# EAGLE design mini48U-v0.6.9 (EAGLE 6.1)
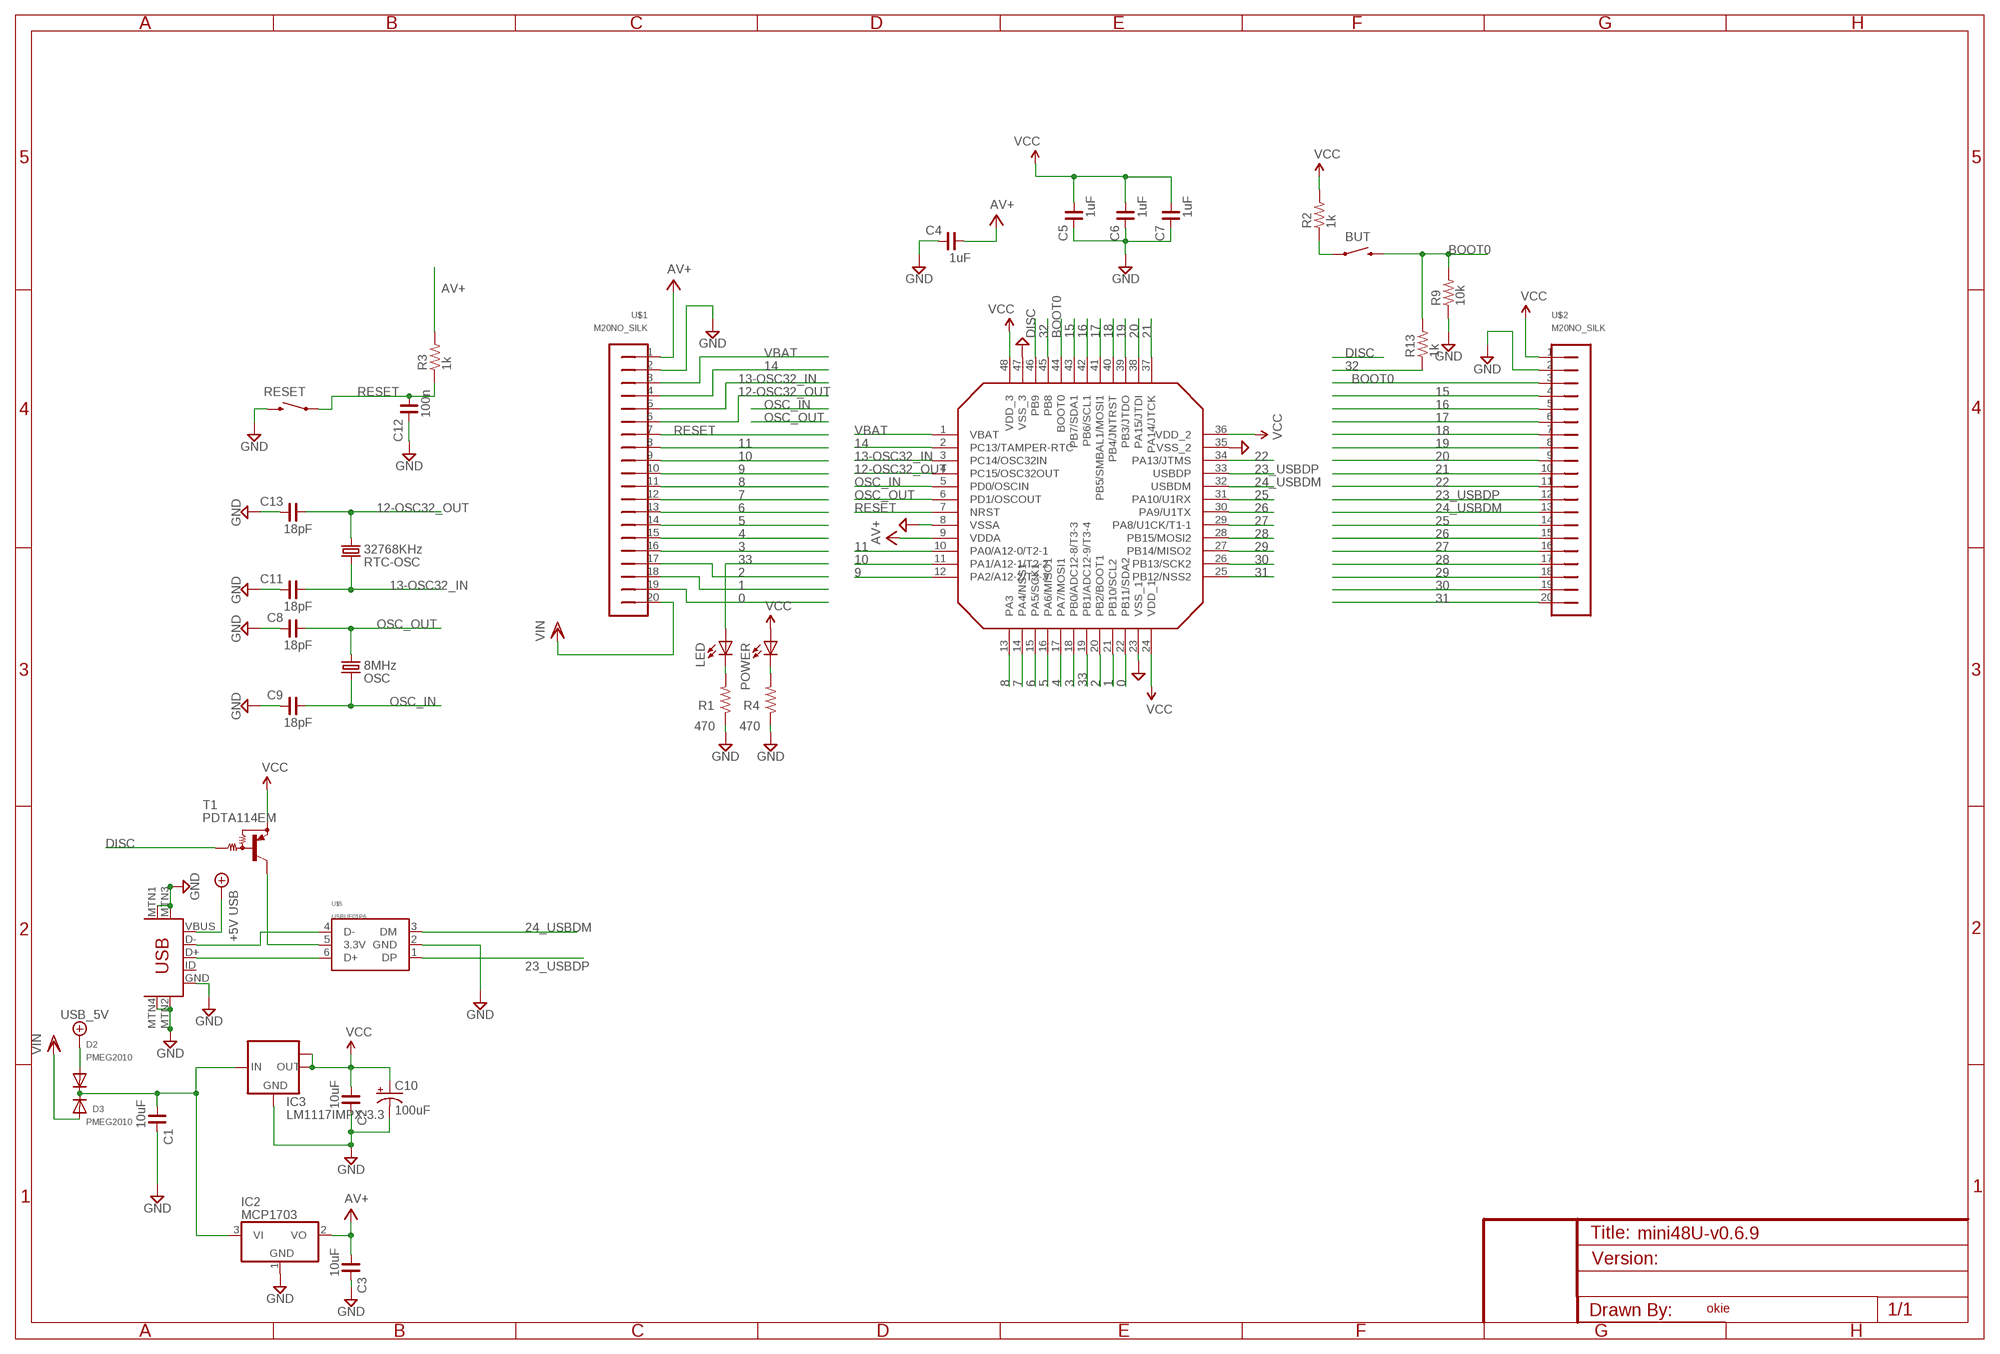
[diagram p0: schematic, sheet 1]

## Parts
BUT  SWITCH-MOMENTARY-2KMR211_NO_GND  [KMR211NG]
C1  10uF  C_0805  [C0805]
C2  10uF  C_0805  [C0805]
C3  10uF  C_0805  [C0805]
C4  1uF  C_0402  [C0402]
C5  1uF  C_0402  [C0402]
C6  1uF  C_0402  [C0402]
C7  1uF  C_0402  [C0402]
C8  18pF  C_0402  [C0402]
C9  18pF  C_0402  [C0402]
C10  100uF  CAP_POL3528  [EIA3528]
C11  18pF  C_0402  [C0402]
C12  100n  C_0402  [C0402]
C13  18pF  C_0402  [C0402]
D2  PMEG2010  DIODESOD-323  [SOD-323]
D3  PMEG2010  DIODESOD-323  [SOD-323]
IC2  MCP1703  [SOT23-3]
IC3  LM1117IMPX-3.3  [SOT223]
LED  LED  LEDKA-3528ASYC  [KA-3528ASYC]
OSC  8MHz  CRYSTALTC38H  [TC38H]
POWER  green  LEDCHIP-LED0603  [CHIP-LED0603]
R1  470  R_0402  [R0402]
R2  1k  R_0402  [R0402]
R3  1k  R_0402  [R0402]
R4  470  R_0402  [R0402]
R9  10k  R_0402  [R0402]
R13  1k  R_0402  [R0402]
RESET  SWITCH-MOMENTARY-2KMR211_NO_GND  [KMR211NG]
RTC-OSC  32768KHz  CRYSTALTC26H  [TC26H]
T1  PDTA114EM  PNP-DRIVERSOT723  [SOT-723]
U$1  M20NO_SILK  [1X20_NO_SILK]
U$2  M20NO_SILK  [1X20_NO_SILK]
U$4  STM32F103_48  [LQFP48-7X7]
U$5  USBUF01P6  [SOT-666]
USB  USB-MINIB-5PIN  [USB-MINIB]

## Nets
0: U$1.19 U$4.22(PB11/SDA2)
1: U$1.18 U$4.21(PB10/SCL2)
2: U$1.17 U$4.20(PB2/BOOT1)
3: U$1.16 U$4.18(PB0/ADC12-8/T3-3)
4: U$1.15 U$4.17(PA7/MOSI1)
5: U$1.14 U$4.16(PA6/MISO1)
6: U$1.13 U$4.15(PA5/SCK1)
7: U$1.12 U$4.14(PA4/NSS1)
8: U$1.11 U$4.13(PA3)
9: U$1.10 U$4.12(PA2/A12-2/T2-3)
10: U$1.9 U$4.11(PA1/A12-1/T2-2)
11: U$1.8 U$4.10(PA0/A12-0/T2-1)
12-OSC32_OUT: C13.1 RTC-OSC.1 U$1.6 U$4.4(PC15/OSC32OUT)
13-OSC32_IN: C11.1 RTC-OSC.2 U$1.5 U$4.3(PC14/OSC32IN)
14: U$1.4 U$4.2(PC13/TAMPER-RTC)
15: U$2.4 U$4.43(PB7/SDA1)
16: U$2.5 U$4.42(PB6/SCL1)
17: U$2.6 U$4.41(PB5/SMBAL1/MOSI1)
18: U$2.7 U$4.40(PB4/JNTRST)
19: U$2.8 U$4.39(PB3/JTDO)
20: U$2.9 U$4.38(PA15/JTDI)
21: U$2.10 U$4.37(PA14/JTCK)
22: U$2.11 U$4.34(PA13/JTMS)
23_USBDP: U$2.12 U$4.33(USBDP) U$5.1(DP)
24_USBDM: U$2.13 U$4.32(USBDM) U$5.3(DM)
25: U$2.14 U$4.31(PA10/U1RX)
26: U$2.15 U$4.30(PA9/U1TX)
27: U$2.16 U$4.29(PA8/U1CK/T1-1)
28: U$2.17 U$4.28(PB15/MOSI2)
29: U$2.18 U$4.27(PB14/MISO2)
30: U$2.19 U$4.26(PB13/SCK2)
31: U$2.20 U$4.25(PB12/NSS2)
32: R13.1 U$4.45(PB8)
33: LED.A U$4.19(PB1/ADC12-9/T3-4)
+5V/2 [vcc]: D2.A USB.VBUS ; supply symbol labelled USB_5V, +5V USB
AV+ [vcc]: C3.1 C4.1 IC2.2(VO) R3.2 U$1.1 U$4.9(VDDA)
BOOT0: BUT.2 R9.2 R13.2 U$2.3 U$4.44(BOOT0)
DGND: C1.2 C2.2 C3.2 C4.2 C5.2 C6.2 C7.2 C8.2 C9.2 C10.C(-) C11.2 C12.2 C13.2 IC2.1(GND) IC3.1(GND) R1.1 R4.1 R9.1 RESET.2 U$1.2 U$2.2 U$4.8(VSSA) U$4.23(VSS_1) U$4.35(VSS_2) U$4.47(VSS_3) U$5.2(GND) USB.GND USB.MTN1(MTN2) USB.MTN2(MTN3) USB.MTN3(MTN1) USB.MTN4 ; supply symbol labelled GND
DISC: T1.1(B) U$4.46(PB9)
N$1: BUT.1 R2.1
N$2: LED.C R1.2
N$3: POWER.C R4.2
N$5 [vcc]: C1.1 D2.C D3.C IC2.3(VI) IC3.3(IN)
N$6: T1.3(C) U$5.5(3.3V)
N$14: U$5.4(D-) USB.D-
N$17: U$5.6(D+) USB.D+
OSC_IN: C9.1 OSC.2 U$4.5(PD0/OSCIN)
OSC_OUT: C8.1 OSC.1 U$4.6(PD1/OSCOUT)
RESET: C12.1 R3.1 RESET.1 U$1.7 U$4.7(NRST)
VBAT: U$1.3 U$4.1(VBAT)
VCC [vcc]: C2.1 C5.1 C6.1 C7.1 C10.A(+) IC3.2(OUT) IC3.TAB(OUT1) POWER.A R2.2 T1.2(E) U$2.1 U$4.24(VDD_1) U$4.36(VDD_2) U$4.48(VDD_3)
VIN [vcc]: D3.A U$1.20
Unconnected: USB.ID

## Notes on the sheet
- BOOT0
- okie

## Library data of the parts
BUT RESET = es:SWITCH-MOMENTARY-2
C1-C9 C11-C13 = rc-master-smd:C_: NON-POLARIZED CAP
C10 = es:CAP_POL: Capacitor Polarized These are standard SMD and PTH capacitors. Normally 10uF, 47uF, and 100uF in electrolytic and tantalum varieties. Always verify the external diameter of the through hole cap, it varies with capacity, voltage, and manufacturer. The EIA devices should be standard.
D2 D3 = es:DIODE: Diode SMADIODE - SMA Surface Mount Package 20V 1A Schottky Diode Digikey: 641-1014-6-ND DO-1N4148 - Through Hole Small Current Diode SOD-123 20V 1 A (.5mV Vf) Schottky Diode - Digikey: MBRX120TPMSCT-ND SOD-323 10V 570mA (.38mV Vf, 3ns) Schottky Diode - Digikey: ZLLS410CT-ND SOD-523 30V 30mA Schottky Diode (RB751S-40TE61) - Digikey: RB751S-40TE61CT-ND SOT23-R/W - SOT23 Package (R = Solder Paste/Reflow Ovens, W = Hand-Soldering) BAT54Film 40V 300mA - Digikey: 497-7162-1-ND
IC2 = es:MCP1703: 250 mA, 16V, Low Quiescent Current LDO Regulator Source: http://ww1.microchip.com/downloads/en/DeviceDoc/22049b.pdf
IC3 = lm1117:LM1117IMPX-*
LED POWER = led:LED: LED OSRAM: - CHIPLED LG R971, LG N971, LY N971, LG Q971, LY Q971, LO R971, LY R971 LH N974, LH R974 LS Q976, LO Q976, LY Q976 LO Q996 - Hyper CHIPLED LW Q18S LB Q993, LB Q99A, LB R99A - SideLED LS A670, LO A670, LY A670, LG A670, LP A670 LB A673, LV A673, LT A673, LW A673 LH A674 LY A675 LS A676, LA A676, LO A676, LY A676, LW A676 LS A679, LY A679, LG A679 - Hyper Micro SIDELED® LS Y876, LA Y876, LO Y876, LY Y876 LT Y87S - SmartLED LW L88C, LW L88S LB L89C, LB L89S, LG L890 LS L89K, LO L89K, LY L89K LS L896, LA L896, LO L896, LY L896 - TOPLED LS T670, LO T670, LY T670, LG T670, LP T670 LSG T670, LSP T670, LSY T670, LOP T670, LYG T670 LG T671, LOG T671, LSG T671 LB T673, LV T673, LT T673, LW T673 LH T674 LS T676, LA T676, LO T676, LY T676, LB T676, LH T676, LSB T676, LW T676 LB T67C, LV T67C, LT T67C, LS T67K, LO T67K, LY T67K, LW E67C LS E67B, LA E67B, LO E67B, LY E67B, LB E67C, LV E67C, LT E67C LW T67C LS T679, LY T679, LG T679 LS T770, LO T770, LY T770, LG T770, LP T770 LB T773, LV T773, LT T773, LW T773 LH T774 LS E675, LA E675, LY E675, LS T675 LS T776, LA T776, LO T776, LY T776, LB T776 LHGB T686 LT T68C, LB T68C - Hyper Mini TOPLED® LB M676 - Mini TOPLED Santana® LG M470 LS M47K, LO M47K, LY M47K Source: http://www.osram.convergy.de LUXEON: - LUMILED® LXK2-PW12-R00, LXK2-PW12-S00, LXK2-PW14-U00, LXK2-PW14-V00 LXK2-PM12-R00, LXK2-PM12-S00, LXK2-PM14-U00 LXK2-PE12-Q00, LXK2-PE12-R00, LXK2-PE12-S00, LXK2-PE14-T00, LXK2-PE14-U00 LXK2-PB12-K00, LXK2-PB12-L00, LXK2-PB12-M00, LXK2-PB14-N00, LXK2-PB14-P00, LXK2-PB14-Q00 LXK2-PR12-L00, LXK2-PR12-M00, LXK2-PR14-Q00, LXK2-PR14-R00 LXK2-PD12-Q00, LXK2-PD12-R00, LXK2-PD12-S00 LXK2-PH12-R00, LXK2-PH12-S00 LXK2-PL12-P00, LXK2-PL12-Q00, LXK2-PL12-R00 Source: www.luxeon.com KINGBRIGHT: KA-3528ASYC Source: www.kingbright.com
OSC RTC-OSC = SparkFun_20110922_my:CRYSTAL: Crystals Various standard crystals. Proven footprints. Spark Fun Electronics SKU : COM-00534
R1-R4 R9 R13 = rc-master-smd:R_: RESISTOR
T1 = es:PNP-DRIVER
U$1 U$2 = es:M20
U$4 = stm32_a:STM32F103_48
U$5 = es:USBUF
USB = SparkFun_20110922_my:USB-MINIB: Mini-USB "B" connector with 5th pin broken out. Created new symbol breaking out 5th "ID" pin in mini/micro USB connector spec. See: http://en.wikipedia.org/wiki/Mini_usb#Cables. Uses same footprint as 4-pin symbol. Also added pins to connect to mounting / shield pads if required (probably not generally needed as signals aren't shielded once they leave the connector).

## Net classes
1 vcc: width 0.25 mm

## Board
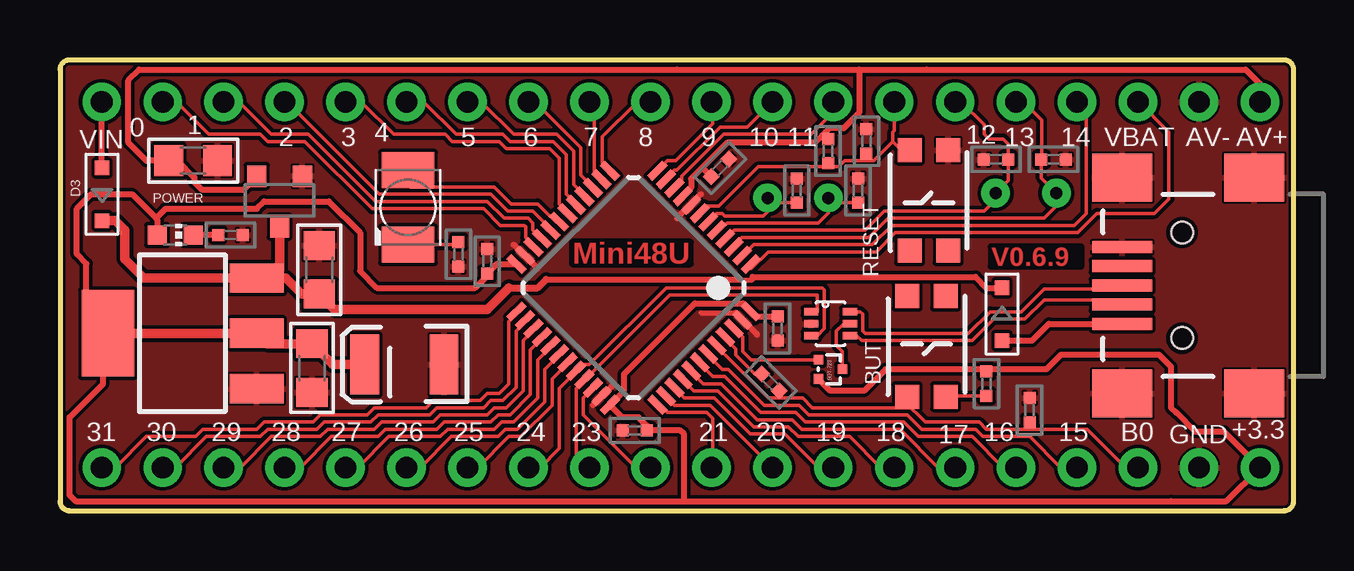
[diagram p1: board, top side]
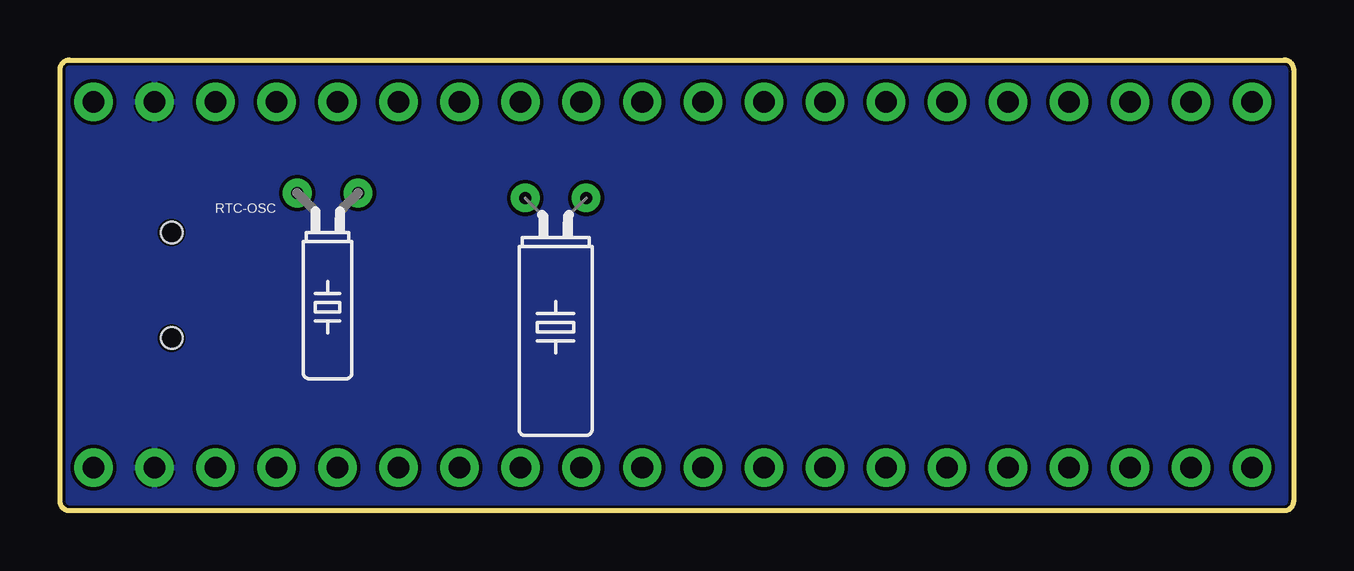
[diagram p2: board, bottom side, seen from below]

Size 51.4 x 18.8 mm. Coordinates in mm from the lower left corner, seen from the top.
Outline: 51,0 arc90 51.4,0.4 51.4,18.4 arc90 51,18.8 0.4,18.8 arc90 0,18.4 0,0.4 arc90 0.4,0 51,0
Copper layers (1*16): Top 0.018mm / dielectric 1.5mm / Bottom 0.018mm
Design rules: minimum track width 0.125mm, minimum drill 0.4mm, track to track 0.15mm, track to pad 0.15mm, pad to pad 0.15mm, via to via 0.15mm, smd to smd 0.15mm, copper to edge 0.12mm, drill to drill 0.15mm, minimum pad ring 0.35mm, minimum via ring 0.35mm, stop-mask expansion 0mil, vias tented up to drill 25mil, thermal gap 0.09mm
tRestrict: 1 lines

### Footprints (pad centres in the part's own frame; a part is rotated, then mirrored left to right if it is on the bottom)
KMR211NG = smd 1 x 1: 1 2.2,0.8; 2 2.2,-0.8; 3 -2,0.8; 4 -2,-0.8
C0805 = smd 1.2 x 1.3: 1 -1.016,0; 2 1.016,0
C0402 = smd 0.5 x 0.5: 1 -0.508,0; 2 0.508,0
EIA3528 = smd 1.2 x 2.5: A 1.65,0; C -1.65,0
SOD-323 = smd 0.6 x 0.6: A 1.1,0; C -1.1,0
SOT23-3 = smd 0.8 x 0.9: 1 -0.95,-1; 2 0.95,-1; 3 0,1.1
SOT223 = smd 1.219 x 2.235: 1 -2.311,-3.099; 2 0,-3.099; 3 2.311,-3.099 | smd 3.6 x 2.2: TAB 0,3.099
KA-3528ASYC = smd 1.5 x 2.2: A -1.55,0; C 1.55,0
TC38H = drill 0.5: 1 -1.27,0; 2 1.27,0
CHIP-LED0603 = smd 0.8 x 0.8: A 0,-0.75; C 0,0.75
R0402 = smd 0.5 x 0.5: 1 -0.508,0; 2 0.508,0
TC26H = drill 0.5: 1 -1.27,0; 2 1.27,0
SOT-723 = smd 0.4 x 0.4: 1 -0.4,-0.6; 2 0.4,-0.6; 3 0,0.4
1X20_NO_SILK = drill 0.9: 1 0,0; 2 2.54,0; 3 5.08,0; 4 7.62,0; 5 10.16,0; 6 12.7,0; 7 15.24,0; 8 17.78,0; 9 20.32,0; 10 22.86,0; 11 25.4,0; 12 27.94,0; 13 30.48,0; 14 33.02,0; 15 35.56,0; 16 38.1,0; 17 40.64,0; 18 43.18,0; 19 45.72,0; 20 48.26,0
LQFP48-7X7 = smd 0.9 x 0.3: 1 -4.15,2.75; 2 -4.15,2.25; 3 -4.15,1.75; 4 -4.15,1.25; 5 -4.15,0.75; 6 -4.15,0.25; 7 -4.15,-0.25; 8 -4.15,-0.75; 9 -4.15,-1.25; 10 -4.15,-1.75; 11 -4.15,-2.25; 12 -4.15,-2.75; 25 4.15,-2.75; 26 4.15,-2.25; 27 4.15,-1.75; 28 4.15,-1.25; 29 4.15,-0.75; 30 4.15,-0.25; 31 4.15,0.25; 32 4.15,0.75; 33 4.15,1.25; 34 4.15,1.75; 35 4.15,2.25; 36 4.15,2.75 | smd 0.3 x 0.9: 13 -2.75,-4.15; 14 -2.25,-4.15; 15 -1.75,-4.15; 16 -1.25,-4.15; 17 -0.75,-4.15; 18 -0.25,-4.15; 19 0.25,-4.15; 20 0.75,-4.15; 21 1.25,-4.15; 22 1.75,-4.15; 23 2.25,-4.15; 24 2.75,-4.15; 37 2.75,4.15; 38 2.25,4.15; 39 1.75,4.15; 40 1.25,4.15; 41 0.75,4.15; 42 0.25,4.15; 43 -0.25,4.15; 44 -0.75,4.15; 45 -1.25,4.15; 46 -1.75,4.15; 47 -2.25,4.15; 48 -2.75,4.15
SOT-666 = smd 0.3 x 0.6: 1 -0.5,-0.8; 2 0,-0.8; 3 0.5,-0.8; 4 0.5,0.81; 5 0,0.81; 6 -0.5,0.81
USB-MINIB = smd 2.5 x 0.5: D+ 2.5,0; D- 2.5,0.8; GND 2.5,-1.6; ID 2.5,-0.8; VBUS 2.5,1.6 | smd 2.5 x 2: MTN1 -3,4.5; MTN2 2.5,4.5; MTN3 -3,-4.5; MTN4 2.5,-4.5 | hole 0.9: 0,2.2; 0,-2.2

### Placement (x,y rotation side)
BUT  36.1,6.95 270 top
C1  10.8,10.05 90 top
C2  10.5,5.95 270 top
C3  5.55,14.6 0 top
C4  27.5,14.3 45 top
C5  23.95,3.35 180 top
C6  17.8,10.4 90 top
C7  29.9,7.6 270 top
C8  30.7,13.35 90 top
C9  33.25,13.35 90 top
C10  14.35,6.1 180 top
C11  41.4,14.65 0 top
C12  33.6,15.4 90 top
C13  39,14.65 180 top
D2  39.25,8.2 270 top
D3  1.75,13.2 90 top
IC2  9.15,12.95 180 top
IC3  5.1,7.4 90 top
LED  14.5,12.65 270 top
OSC  30.75,13.05 180 bottom
POWER  4.8,11.5 270 top
R1  16.6,10.7 90 top
R2  38.6,5.3 90 top
R3  32,15 90 top
R4  7.1,11.5 180 top
R9  40.4,4.2 270 top
R13  29.6,5.35 315 top
RESET  36.2,12.85 90 top
RTC-OSC  40.25,13.25 180 bottom
T1  32.2,5.9 270 top
U$1  50,17.05 180 top
U$2  50,1.8 180 top
U$4  23.9,9.3 225 top
U$5  32.1,7.8 270 top
USB  46.75,9.4 180 top

### Tracks (layer width: path | path; a pad name or v marks a point on that pad's centre or on a via)
0
  Top 0.15: U$4.22 19.73,11.07 19.4,11.4 19.4,11.85 19.35,11.9 18.35,11.9 17.65,12.6 13,12.6 10.2,15.4 8.65,15.4 8.35,15.7 6.2,15.7 4.9,17 4.33,17 U$1.19
1
  Top 0.15: U$4.21 20.05,11.35 19.7,11.7 19.7,12 19.5,12.2 18.5,12.2 17.8,12.9 13.15,12.9 10.35,15.7 8.8,15.7 7.5,17 6.87,17 U$1.18
2
  Top 0.15: U$4.20 20.44,11.77 19.7,12.5 18.65,12.5 17.95,13.2 13.3,13.2 9.4,17.1 9.4,17.01 U$1.17
3
  Top 0.15: U$4.18 21.14,12.46 20.8,12.8 20.8,14.7 20.4,15.1 18.6,15.1 18.3,15.4 16.35,15.4 16.05,15.7 13.9,15.7 12.6,17 11.95,17 U$1.16
4
  Top 0.15: U$4.17 21.5,12.8 21.1,13.2 21.1,14.85 20.55,15.4 18.75,15.4 18.45,15.7 16.5,15.7 15.2,17 14.49,17 U$1.15
5
  Top 0.15: U$4.16 21.85,13.15 21.4,13.6 21.4,15 20.7,15.7 18.9,15.7 17.6,17 17.03,17 U$1.14
6
  Top 0.15: U$4.15 22.2,13.5 21.7,14 21.7,15.15 19.85,17 19.57,17 U$1.13
7
  Top 0.15: U$4.14 22.56,13.84 22.25,14.15 22.25,17.05 U$1.12
8
  Top 0.15: U$4.13 22.6,14.5 22.6,15.6 24,17 24.55,17 U$1.11
9
  Top 0.15: U$4.12 25.3,14.6 25.65,14.6 27.2,16.15 27.2,16.99 U$1.10
10
  Top 0.15: U$4.11 25.24,13.84 25.6,14.2 25.7,14.2 27.5,16 28.63,16 U$1.9
11
  Top 0.15: U$4.10 25.6,13.5 25.9,13.8 25.9,13.95 27.65,15.7 31.3,15.7 32.2,16.6 32.22,16.62 U$1.8
12-OSC32_OUT
  Top 0.15: U$4.4 27.75,11.35 28.1,11.7 30,11.7 33.55,11.7 34.35,12.5 38.5,12.5 38.8,12.8 38.8,13.07 RTC-OSC.1 39.51,13.78 C13.1 39.5,15.3 39.3,15.5 38.7,15.5 38.5,15.7 38.5,16.1 37.55,17.05 U$1.6
13-OSC32_IN
  Top 0.15: U$4.3 28.07,11.07 28.4,11.4 33.7,11.4 34.5,12.2 40.95,12.2 41,12.2 41.5,12.7 41.5,13.23 RTC-OSC.2 40.89,13.88 C11.1 40.9,16.3 40.3,16.9 | 40.3,16.9 40.2,17 | U$1.5 40.15,17.05 40.3,16.9
14
  Top 0.15: U$4.2 28.44,10.64 28.9,11.1 29.1,11.1 29.7,11.1 33.85,11.1 34.65,11.9 42.25,11.9 42.75,12.4 42.75,16.65 42.4,17 42.43,17 | 42.43,17 U$1.4 42.43,17 | 42.43,17 42.6,16.83
15
  Top 0.15: U$4.43 26.96,6.54 27.6,5.9 27.85,5.9 29.35,4.4 30.8,4.4 31.2,4 35.3,4 35.9,3.4 38.15,3.4 38.45,3.1 40.4,3.1 41.7,1.8 U$2.4 42.3,1.88
16
  Top 0.15: U$4.42 26.61,6.19 27.2,5.6 27.7,5.6 29.2,4.1 30.65,4.1 31.05,3.7 35.15,3.7 35.75,3.1 38,3.1 39.3,1.8 U$2.5
17
  Top 0.15: U$4.41 26.27,5.83 26.8,5.3 27.55,5.3 29.05,3.8 30.5,3.8 30.9,3.4 35,3.4 36.6,1.8 U$2.6
18
  Top 0.15: U$4.40 25.92,5.48 26.4,5 27.4,5 28.9,3.5 30.35,3.5 30.75,3.1 32.9,3.1 34.2,1.8 U$2.7
19
  Top 0.15: U$4.39 25.57,5.13 26,4.7 27.25,4.7 28.75,3.2 30.2,3.2 31.55,1.85 32.17,1.85 U$2.8
20
  Top 0.15: U$4.38 25.24,4.76 25.6,4.4 27.1,4.4 29.7,1.8 29.7,1.82 U$2.9
21
  Top 0.15: U$4.37 24.98,4.42 25.3,4.1 26.95,4.1 27.2,3.85 27.2,1.86 U$2.10
22
  Top 0.15: U$4.34 22.2,5.1 21.8,4.7 21.8,4 24,1.8 U$2.11
23_USBDP
  Top 0.15: U$2.12 21.6,1.8 21.5,1.9 21.5,5.1 21.85,5.45 U$4.33 21.88,5.48 25.4,9 31.55,9 31.55,8.3 U$5.1
24_USBDM
  Top 0.15: U$2.13 20,1.8 20.8,2.6 20.8,5.1 21.5,5.8 U$4.32 21.54,5.83 21.8,6.1 22.05,6.1 25.25,9.3 31.75,9.3 31.85,9.2 31.85,7.6 31.55,7.3 U$5.3
25
  Top 0.15: U$4.31 21.14,6.14 20.5,5.5 20.5,4.4 19.2,3.1 18.7,3.1 17.4,1.8 U$2.14
26
  Top 0.15: U$4.30 20.79,6.49 20.2,5.9 20.2,4.55 19.05,3.4 18.55,3.4 18.25,3.1 16.3,3.1 15,1.8 U$2.15
27
  Top 0.15: U$4.29 20.44,6.84 19.9,6.3 19.9,4.7 18.9,3.7 18.4,3.7 18.1,3.4 16.15,3.4 15.85,3.1 13.7,3.1 12.4,1.8 U$2.16
28
  Top 0.15: U$4.28 20.08,7.18 19.6,6.7 19.6,4.85 18.75,4 18.25,4 17.95,3.7 16,3.7 15.7,3.4 13.55,3.4 13.25,3.1 11.3,3.1 10,1.8 U$2.17
29
  Top 0.15: U$4.27 19.73,7.53 19.3,7.1 19.3,5 18.6,4.3 18.1,4.3 17.8,4 15.85,4 15.55,3.7 13.4,3.7 13.1,3.4 11.15,3.4 10.85,3.1 8.8,3.1 7.5,1.8 U$2.18
30
  Top 0.15: U$4.26 19.37,7.87 19,7.5 19,5.15 18.45,4.6 17.95,4.6 17.65,4.3 15.7,4.3 15.4,4 13.25,4 12.95,3.7 11,3.7 10.7,3.4 8.65,3.4 8.35,3.1 6.1,3.1 4.8,1.8 U$2.19
31
  Top 0.15: U$4.25 19.02,8.22 18.7,7.9 18.7,5.3 18.3,4.9 17.8,4.9 17.5,4.6 15.55,4.6 15.25,4.3 13.1,4.3 12.8,4 10.85,4 10.55,3.7 8.5,3.7 8.2,3.4 5.95,3.4 5.65,3.1 3.6,3.1 2.3,1.8 U$2.20
32
  Top 0.15: U$4.45 27.72,7.18 28.15,6.75 28.15,6.5 28.95,5.7 R13.1
33
  Top 0.15: U$4.19 20.74,12.06 20.5,12.3 20.4,12.3 19.9,12.8 18.8,12.8 18.1,13.5 14.6,13.5 14.5,13.6 LED.A
+5V/2
  Top 0.25: USB.VBUS 41.2,7.8 40.5,7.1 D2.A
AV+
  Top 0.25: 33.3,18.4 25.7,18.4 3.3,18.4 2.85,17.95 2.85,16.05 2.85,15.35 3.6,14.6 C3.1 | 33.3,18.4 36.1,18.4 49.4,18.4 50,17.8 U$1.1 | 26.73,14.27 26.3,13.85 26.3,13.47 U$4.9 | 26.73,14.27 27.8,15.35 31.4,15.35 31.45,15.35 31.75,15.65 | C4.1 26.81,14.27 26.73,14.27 | 33.3,18.4 33.3,16.6 32.65,15.95 32.05,15.95 31.9,15.8 31.75,15.65 | R3.2 31.89,15.51 31.75,15.65 | C3.1 4.9,14.6 | 4.9,14.6 5.6,13.9 5.6,13.7 5.9,13.4 7.65,13.4 IC2.2 | C3.1 4.9,14.6
BOOT0
  Top 0.15: 29.95,4.7 29.5,4.7 28,6.2 27.37,6.84 U$4.44 | 29.95,4.7 30.95,4.7 31.35,4.3 35.3,4.3 | 40.4,3.4 38.6,3.4 38.3,3.7 36.3,3.7 36.05,3.7 35.77,3.97 35.48,4.28 35.45,4.3 35.3,4.3 | 40.4,3.4 40.7,3.4 42.1,3.4 42.3,3.4 42.8,3.4 44.4,1.8 U$2.3 | R13.2 29.96,4.71 29.95,4.7 | 35.3,4.3 BUT.2 | 40.4,3.4 R9.2
DGND
  Top 0.2: 26.7,8.25 28.15,8.25
  Top 0.25: 26.7,13.2 25.7,12.2 | 28.15,8.25 29.05,7.35 | 19.9,10.1 18.9,11.1 19.9,10.1 | 22.2,4.4 23,5.2 22.2,4.4
  pour Top: -0.7,21.9 -0.7,-2.8 51.7,-2.8 51.7,21.9
  pour Bottom: -0.9,21.6 -0.9,-3.1 51.5,-3.1 51.5,21.6
DISC
  Top 0.15: U$4.46 28.1,7.6 28.45,7.25 28.45,6.65 28.8,6.3 30.75,6.3 31.28,6.3 T1.1
N$1
  Top 0.15: R2.1 36.94,4.79 BUT.1
N$2
  Top 0.15: LED.C 16.49,11.1 R1.2
N$3
  Top 0.25: R4.2 POWER.C
N$5
  Top 0.2: 28.25,9.65 28.25,9.62 28.85,9.62 28.85,9.75
  Top 0.25: 20.25,9.65 28.25,9.65 | 28.85,9.75 38.15,9.75 38.6,9.3 D2.C | IC3.3 8.8,9.7 9.15,10.05
  Top 0.3: 20.25,9.65 19.9,9.3 18.7,9.3
  Top 0.4: 18.7,9.3 17.8,8.4 11.43,8.4 C1.1 10.07,9.03 9.4,9.7 8.8,9.7 | IC3.3 3.49,9.71 2.7,10.5 2.7,11.7 2.3,12.1 D3.C | 9.15,10.05 IC2.3
N$6
  Top 0.15: U$5.5 32.65,7.8 32.35,7.5 32.35,6.9 32.6,6.65 T1.3
N$14
  Top 0.15: U$5.4 33.2,7.3 33.4,7.1 38,7.1 38.9,8 40.2,8 41,8.8 44.05,8.8 USB.D-
N$17
  Top 0.15: USB.D+ 44.1,9.25 41,9.25 40.05,8.3 38.75,8.3 37.85,7.4 33.55,7.4 33.45,7.5 33.45,8.2 33.35,8.3 U$5.6
OSC_IN
  Top 0.15: U$4.5 27.4,11.7 27.65,11.95 27.75,11.95 27.8,12 31.6,12 32.02,12.42 OSC.2 32.23,12.84 C9.1
OSC_OUT
  Top 0.15: C8.1 29.69,12.84 OSC.1 29.5,13.03 29.5,12.5 29.3,12.3 27.7,12.3 27.6,12.4 27.35,12.4 U$4.6
RESET
  Top 0.15: U$4.7 26.95,12.71 27.46,12.71 29.1,14.35 31.95,14.35 32,14.35 | 32,14.35 32.45,14.35 32.7,14.6 33.7,14.6 | 33.7,14.6 33.9,14.6 34.7,15.4 | 32,14.35 R3.1 | U$1.7 34.76,15.85 34.7,15.79 34.7,15.4 | 35.3,14.61 RESET.1 35.05,15.05 34.7,15.4 | C12.1 33.6,14.7 33.7,14.6
VBAT
  Top 0.15: U$4.1 28.78,10.12 28.8,10.1 29.5,10.8 34,10.8 34.8,11.6 42.4,11.6 43.2,12.4 45.6,12.4 46.2,13 46.2,15.8 44.9,17.1 44.9,17.03 U$1.3
VCC
  Top 0.25: 26,0.4 0.65,0.4 0.4,0.65 0.4,3.85 0.4,3.9 1.8,5.3 1.8,7.2 IC3.TAB | 26,0.4 46.3,0.4 48.6,0.4 U$2.1 48.5,3.3 47.3,3.3 46.5,4.1 | C7.1 28.98,8.11 U$4.48 28.7,8.39 28.7,8.4 28.45,8.65 26.45,8.65 23.5,5.7 23.5,5 22.9,4.4 U$4.36 23.43,3.9 24.1,3.9 24.45,3.55 24.46,3.54 C5.1 25.85,3.35 26,3.2 26,0.4 | 18.21,10.3 U$4.24 | 18.21,10.3 18.2,10.3 | T1.2 32.1,5 33.5,5 34.4,5.9 38.7,5.9 | 46.5,4.1 46.3,4.3 46.3,6 45.8,6.5 41.7,6.5 41.1,5.9 38.7,5.9 | 46.5,4.1 46.5,4.11 | R2.2 38.7,5.9 | 18.21,10.3 C6.1 17.8,9.8 17.4,9.4 17.3,9.3 13.2,9.3 12.5,10 12.5,11.6 11.2,12.9 8.5,12.9 8.2,12.6 4.4,12.6 4,12.2 | 2.5,7.4 IC3.TAB | IC3.TAB 1.1,7.4 1.1,10.3 0.7,10.7 0.7,12.6 1.3,13.2 3,13.2 4,12.2 | POWER.A 4.05,12.15 4,12.2
  Top 0.4: C10.A 11.37,6.1 C2.1 8.63,6.97 IC3.2 2.5,7.4 IC3.TAB
VIN
  Top 0.25: U$1.20 D3.A
(copper drawn outside any net)
  shapes: Top circle x2

### Text on the board
Top: Mini48U | V0.6.9
_tsilk: 0 | 1 | VIN | 2 | 3 | 4 | 5 | 6 | 7 | 8 | 9 | 10 | 11 | 12 | 13 | 14 | VBAT | AV- | AV+ | 31 | 30 | 29 | 28 | 27 | 26 | 25 | 24 | 23 | 21 | 20 | 19 | 18 | 17 | 16 | 15 | B0 | GND | +3.3